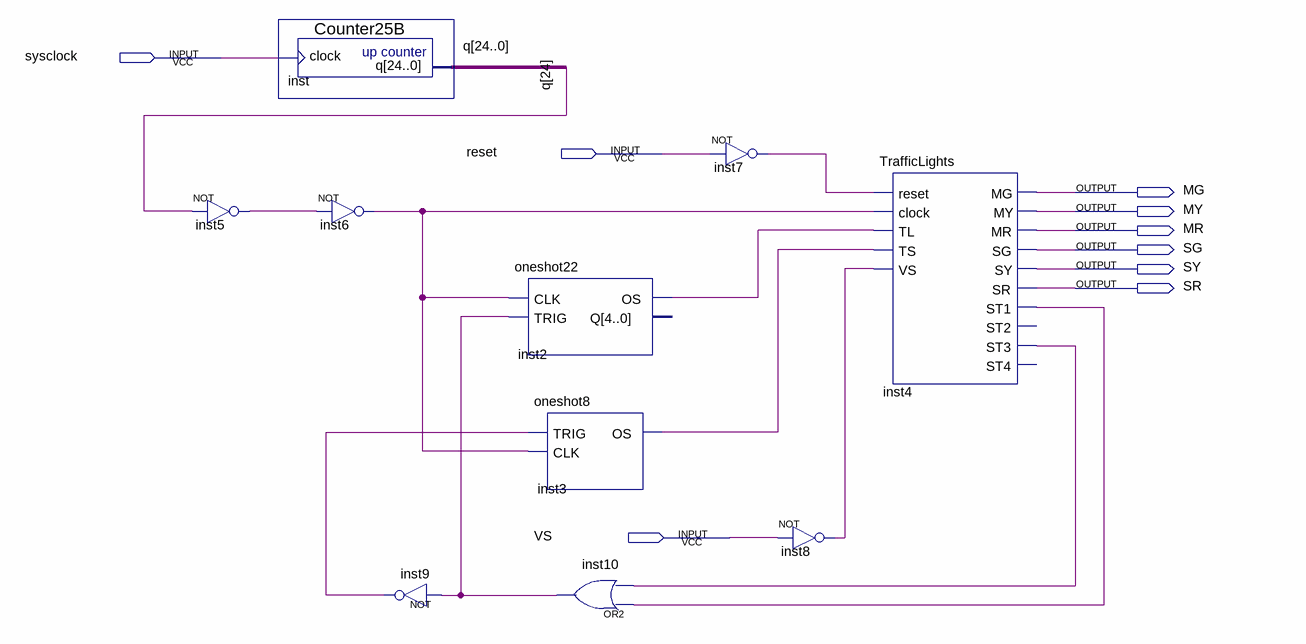
[diagram p0: schematic sheet]
// Quartus schematic TLSystem.bdf as structural Verilog: 10 symbols, 9 pins
module TLSystem (
  input  sysclock,
  input  reset,
  input  VS,
  output MG,
  output MY,
  output MR,
  output SG,
  output SY,
  output SR
);

  wire inst2_os, inst3_os, inst4_st1, inst4_st3, inst5_out, inst6_out, inst7_out, inst8_out, inst9_out,
       inst10_out;
  wire [24:0] q;

  not inst5 (inst5_out, q[24]);
  Counter25B inst (.clock(sysclock), .q(q));
  not inst6 (inst6_out, inst5_out);
  not inst9 (inst9_out, inst10_out);
  oneshot22 inst2 (.CLK(inst6_out), .TRIG(inst10_out), .OS(inst2_os));  // open: Q
  oneshot8 inst3 (.TRIG(inst9_out), .CLK(inst6_out), .OS(inst3_os));
  or inst10 (inst10_out, inst4_st1, inst4_st3);
  not inst7 (inst7_out, reset);
  not inst8 (inst8_out, VS);
  TrafficLights inst4 (
    .reset(inst7_out), .clock(inst6_out), .TL(inst2_os), .TS(inst3_os), .VS(inst8_out), .MG(MG), .MY(MY),
    .MR(MR), .SG(SG), .SY(SY), .SR(SR), .ST1(inst4_st1), .ST3(inst4_st3));  // open: ST2, ST4
endmodule
